# EAGLE design schema_v1_0 (EAGLE 5.12)
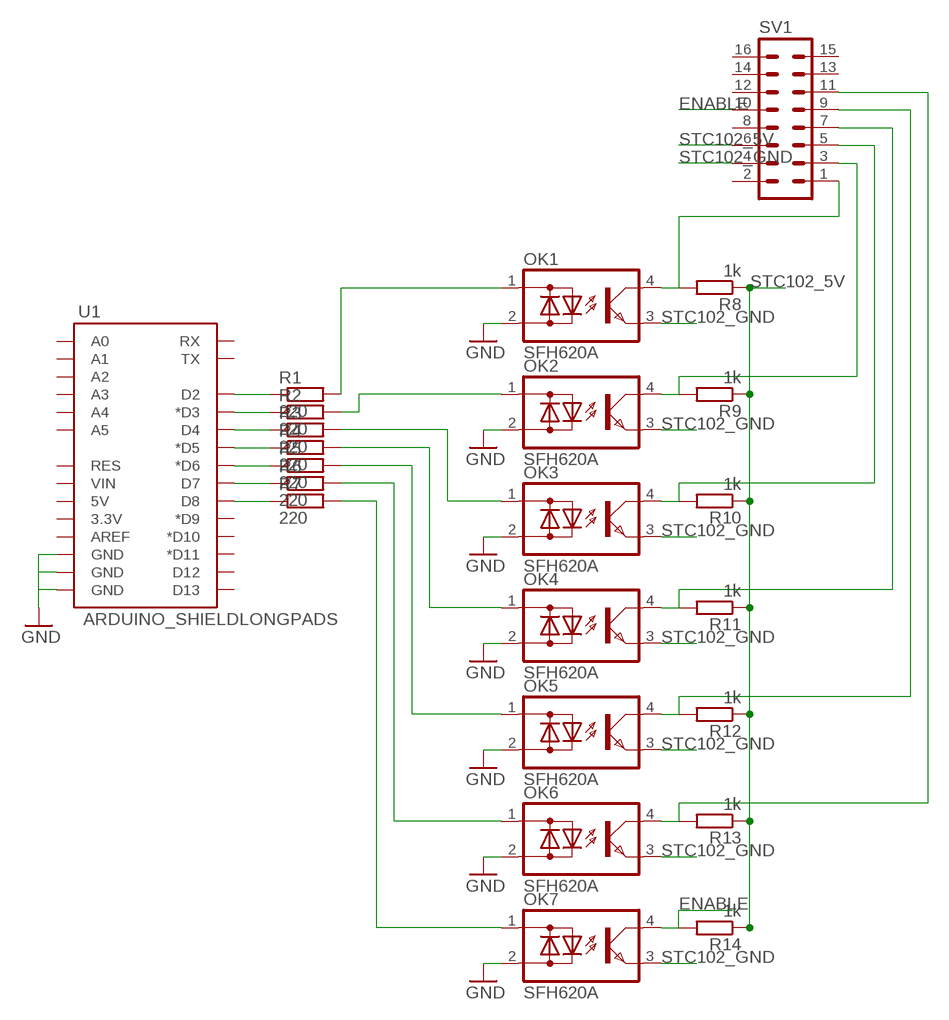
[diagram p0: schematic, sheet 1]

## Parts
OK1  SFH620A  [DIL04]
OK2  SFH620A  [DIL04]
OK3  SFH620A  [DIL04]
OK4  SFH620A  [DIL04]
OK5  SFH620A  [DIL04]
OK6  SFH620A  [DIL04]
OK7  SFH620A  [DIL04]
R1  220  R-EU_0207/10  [0207/10]
R2  220  R-EU_0207/10  [0207/10]
R3  220  R-EU_0207/10  [0207/10]
R4  220  R-EU_0207/10  [0207/10]
R5  220  R-EU_0207/10  [0207/10]
R6  220  R-EU_0207/10  [0207/10]
R7  220  R-EU_0207/10  [0207/10]
R8  1k  R-EU_0207/10  [0207/10]
R9  1k  R-EU_0207/10  [0207/10]
R10  1k  R-EU_0207/10  [0207/10]
R11  1k  R-EU_0207/10  [0207/10]
R12  1k  R-EU_0207/10  [0207/10]
R13  1k  R-EU_0207/10  [0207/10]
R14  1k  R-EU_0207/10  [0207/10]
SV1  MA08-2  [MA08-2]
U1  ARDUINO_SHIELDLONGPADS  [DUEMILANOVE_SHIELD_LONGPADS]

## Nets
ENABLE: OK7.4(C) R14.2 SV1.10
GND: OK1.2(AC2) OK2.2(AC2) OK3.2(AC2) OK4.2(AC2) OK5.2(AC2) OK6.2(AC2) OK7.2(AC2) U1.GND@0(GND) U1.GND@1(GND) U1.GND@2(GND)
N$1: R1.1 U1.D2
N$2: R2.1 U1.D3(*D3)
N$3: R3.1 U1.D4
N$4: R4.1 U1.D5(*D5)
N$5: R5.1 U1.D6(*D6)
N$6: R6.1 U1.D7
N$7: R7.1 U1.D8
N$8: OK1.4(C) R8.2 SV1.1
N$9: OK2.4(C) R9.2 SV1.3
N$10: OK3.4(C) R10.2 SV1.5
N$11: OK4.4(C) R11.2 SV1.7
N$12: OK5.4(C) R12.2 SV1.9
N$13: OK6.4(C) R13.2 SV1.11
N$23: OK1.1(AC1) R1.2
N$24: OK2.1(AC1) R2.2
N$25: OK3.1(AC1) R3.2
N$26: OK4.1(AC1) R4.2
N$27: OK5.1(AC1) R5.2
N$28: OK6.1(AC1) R6.2
N$29: OK7.1(AC1) R7.2
STC102_5V: R8.1 R9.1 R10.1 R11.1 R12.1 R13.1 R14.1 SV1.6
STC102_GND: OK1.3(E) OK2.3(E) OK3.3(E) OK4.3(E) OK5.3(E) OK6.3(E) OK7.3(E) SV1.4
Unconnected: SV1.2 SV1.8 SV1.12 SV1.13 SV1.14 SV1.15 SV1.16 U1.3.3V U1.5V U1.A0 U1.A1 U1.A2 U1.A3 U1.A4 U1.A5 U1.AREF U1.D9(*D9) U1.D10(*D10) U1.D11(*D11) U1.D12 U1.D13 U1.RES U1.RX U1.TX U1.VIN

## Library data of the parts
OK1-OK7 = optocoupler:SFH620: Optocoupler, Phototransistor Output, AC Input Source: http://www.vishay.com/docs/83675/sfh620.pdf; MPN: SFH620A-2; OC_FARNELL: 1469594; OC_NEWARK: 97K9546
R1-R14 = rcl:R-EU_: RESISTOR, European symbol
SV1 = con-lstb:MA08-2: PIN HEADER; OC_FARNELL: unknown; OC_NEWARK: unknown
U1 = SparkFun:ARDUINO_SHIELD

## Board
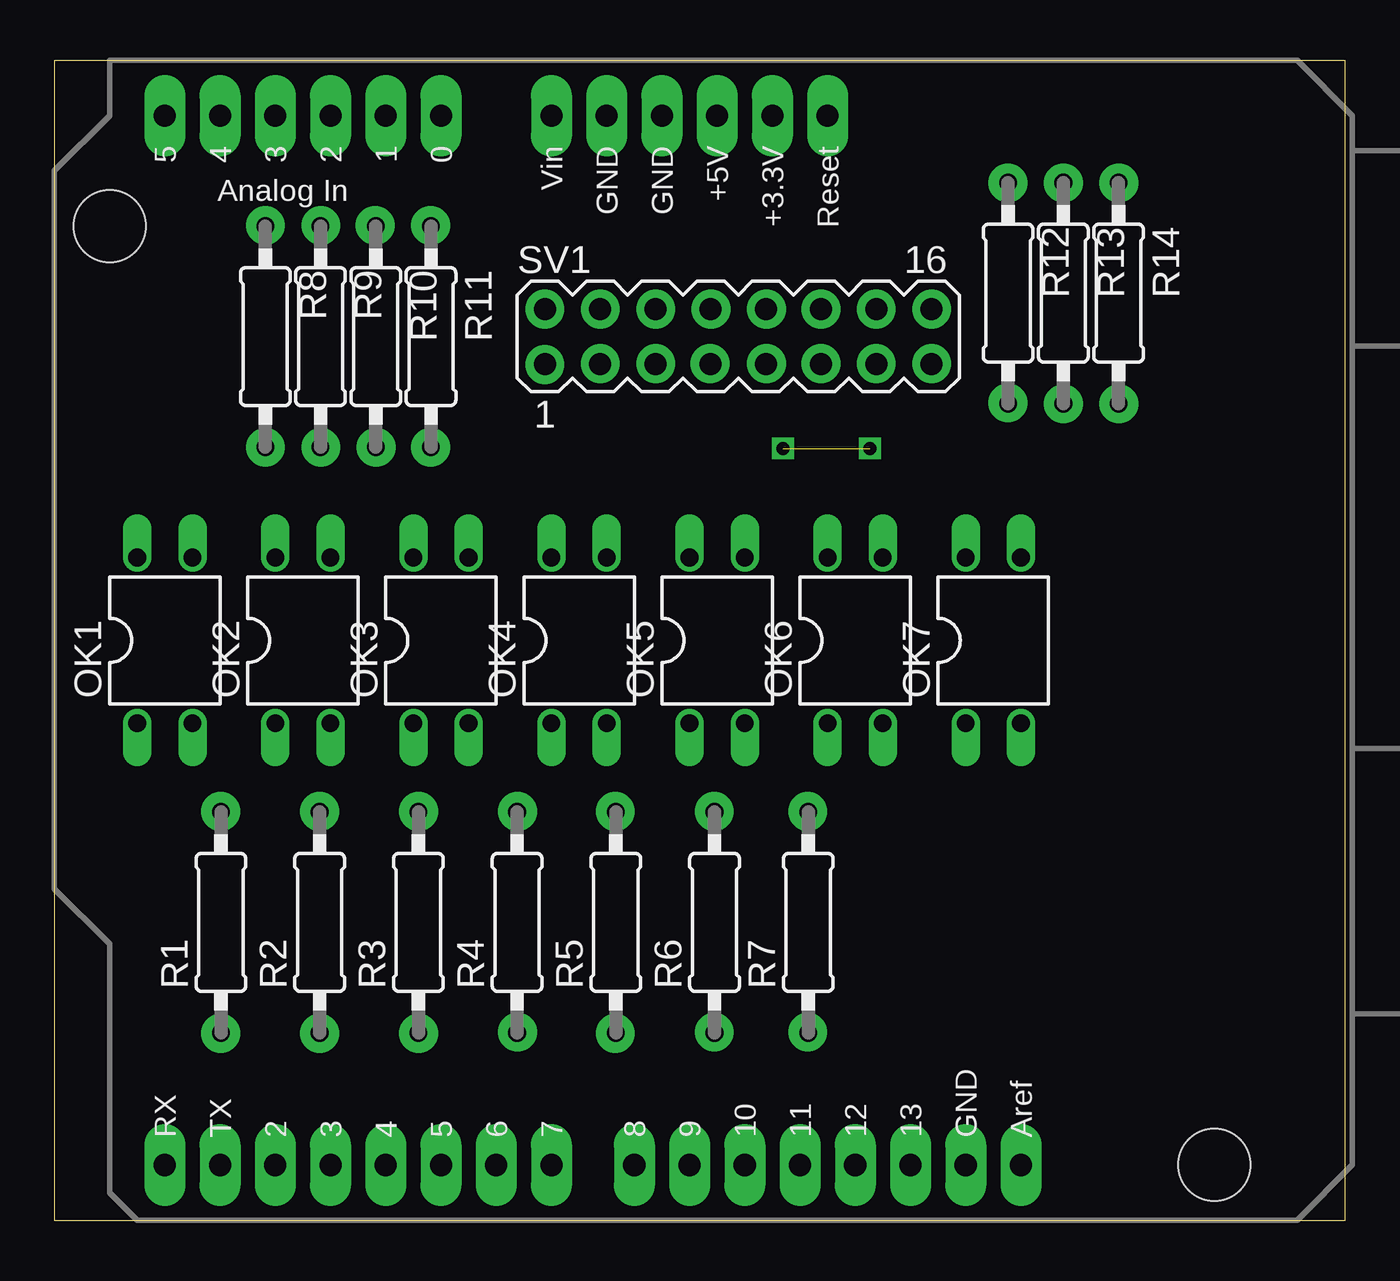
[diagram p1: board, top side]
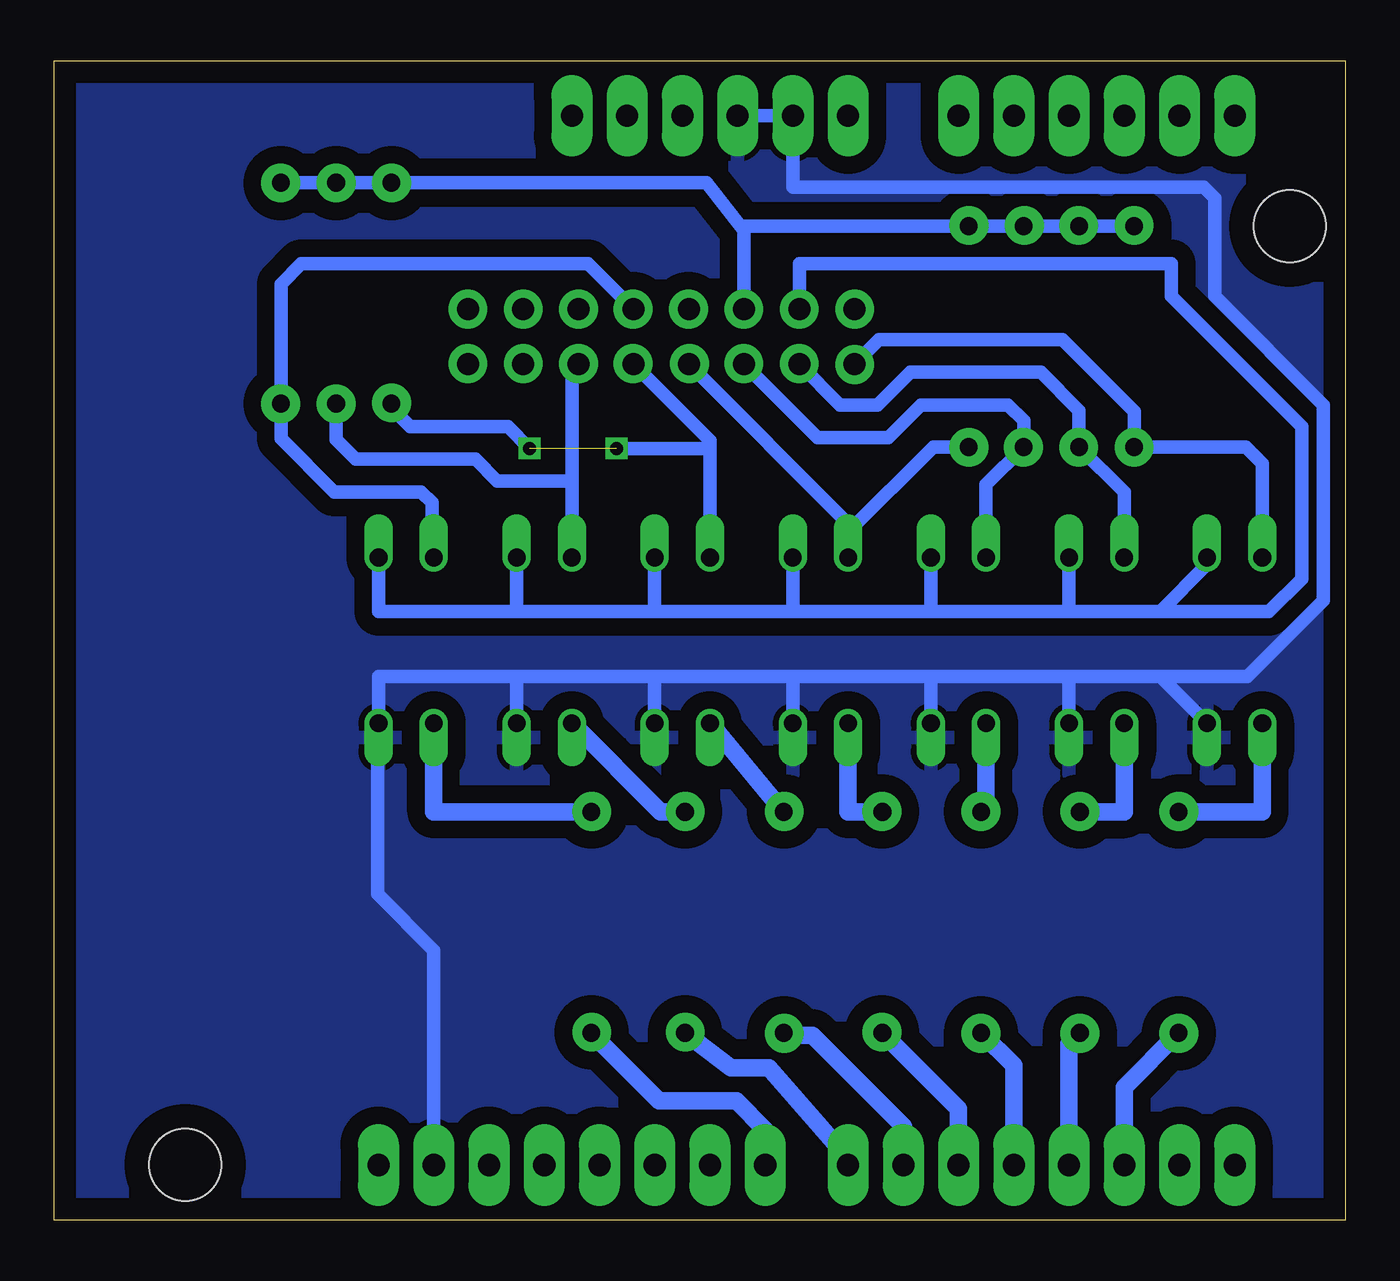
[diagram p2: board, bottom side, seen from below]

Size 59.36 x 53.33 mm. Coordinates in mm from the lower left corner, seen from the top.
Outline: 0,0 59.36,0 59.36,53.33 0,53.33 0,0
Copper layers (1*16): layer 1 0.035mm / dielectric 1.5mm / Bottom 0.035mm
Design rules "default": minimum track width 10mil, minimum drill 24mil, track to track 8mil, track to pad 8mil, pad to pad 8mil, via to via 8mil, smd to smd 8mil, copper to edge 40mil, drill to drill 8mil, minimum pad ring 10mil, minimum via ring 8mil, stop-mask expansion 4mil, vias tented up to drill 0mil, thermal gap 10mil

### Footprints (pad centres in the part's own frame; a part is rotated, then mirrored left to right if it is on the bottom)
DIL04 = drill 0.813 offset: 1 -1.27,-3.81; 2 1.27,-3.81; 3 1.27,3.81; 4 -1.27,3.81
0207/10 = drill 0.813 octagon: 1 -5.08,0; 2 5.08,0
MA08-2 = drill 1.016 octagon: 1 -8.89,-1.27; 2 -8.89,1.27; 3 -6.35,-1.27; 4 -6.35,1.27; 5 -3.81,-1.27; 6 -3.81,1.27; 7 -1.27,-1.27; 8 -1.27,1.27; 9 1.27,-1.27; 10 1.27,1.27; 11 3.81,-1.27; 12 3.81,1.27; 13 6.35,-1.27; 14 6.35,1.27; 15 8.89,-1.27; 16 8.89,1.27
DUEMILANOVE_SHIELD_LONGPADS = drill 1.016 pad 1.88 long: 3.3V 50.8,26.67; 5V 50.8,29.21; A0 50.8,41.91; A1 50.8,44.45; A2 50.8,46.99; A3 50.8,49.53; A4 50.8,52.07; A5 50.8,54.61; AREF 2.54,15.24; D2 2.54,49.53; D3 2.54,46.99; D4 2.54,44.45; D5 2.54,41.91; D6 2.54,39.37; D7 2.54,36.83; D8 2.54,33.02; D9 2.54,30.48; D10 2.54,27.94; D11 2.54,25.4; D12 2.54,22.86; D13 2.54,20.32; GND@0 50.8,31.75; GND@1 50.8,34.29; GND@2 2.54,17.78; RES 50.8,24.13; RX 2.54,54.61; TX 2.54,52.07; VIN 50.8,36.83 | hole 3.302: 45.72,57.15; 2.54,6.35

### Placement (x,y rotation side)
OK1  5.08,26.67 0 top
OK2  11.43,26.67 0 top
OK3  17.78,26.67 0 top
OK4  24.13,26.67 0 top
OK5  30.48,26.67 0 top
OK6  36.83,26.67 0 top
OK7  43.18,26.67 0 top
R1  7.66,13.7 90 top
R2  12.2,13.7 90 top
R3  16.74,13.7 90 top
R4  21.28,13.7 90 top
R5  25.82,13.7 90 top
R6  30.36,13.7 90 top
R7  34.67,13.7 90 top
R8  9.7,40.64 270 top
R9  12.24,40.64 270 top
R10  14.78,40.64 270 top
R11  17.32,40.64 270 top
R12  43.86,42.64 270 top
R13  46.4,42.64 270 top
R14  48.94,42.64 270 top
SV1  31.45,40.64 0 top
U1  59.69,0 90 top

### Tracks (layer width: path | path; a pad name or v marks a point on that pad's centre or on a via)
ENABLE
  Bottom 0.61: SV1.10 34.81,44 48,44 48.94,43.06 R14.2 48.94,35.94 46.5,33.5 42.5,33.5 42,33 42,30.57 OK7.4
GND
  Bottom 0.61: 8.49,25 OK1.2 | 8.49,25 12.7,25 | 12.7,25 OK2.2 | 19.05,25 OK3.2 | 12.7,25 19.05,25 | 25.4,25 OK4.2 | 19.05,25 25.4,25 | 31.75,25 OK5.2 | 25.4,25 31.75,25 | 38.1,25 OK6.2 | 31.75,25 38.1,25 | 38.1,25 44.45,25 OK7.2 44.5,22.81 44.5,15 41.91,12.41 U1.GND@2 | U1.GND@0 U1.GND@1 25.4,47.5 6.5,47.5 6,47 6,42.5 1,37.5 1,28.5 4.5,25 8.49,25
  pour Bottom (isolate 0.813): 0.5,53 59,53 59,0.5 0.5,0.5
N$1
  Bottom 0.813: U1.D2 10.16,6.12 R1.1
N$2
  Bottom 0.61: 12.7,8.12 R2.1
  Bottom 0.813: U1.D3 12.7,8.12
N$3
  Bottom 0.813: U1.D4 15.24,7.12 R3.1
N$4
  Bottom 0.813: U1.D5 17.78,5.12 R4.1
N$5  (via drill 0.5 pad 1.78)
  Bottom 0.61: 25.7,8.5 v25.8,8.6 R5.1
  Bottom 0.813: U1.D6 20.32,4.32 24.5,8.5 25.7,8.5
N$6
  Bottom 0.813: U1.D7 22.86,2.86 26.5,7 28.24,7 R6.1
N$7
  Bottom 0.813: U1.D8 26.67,4.17 28,5.5 31.55,5.5 R7.1
N$8
  Bottom 0.61: OK1.4 3.81,34.81 4.56,35.56 R8.2 9.7,37.2 13,40.5 21.43,40.5 SV1.1
N$9
  Bottom 0.61: OK2.4 10.16,33.48 R9.2 12.24,37.24 14,39 20,39 21.5,37.5 23.23,37.5 SV1.3
N$10
  Bottom 0.61: OK3.4 16.51,33.83 R10.2 14.78,36.78 15.5,37.5 19.5,37.5 21,36 24.27,36 SV1.5
N$11
  Bottom 0.61: R11.2 18.94,35.56 22.86,31.64 OK4.4 22.86,32.05 SV1.7
N$12  (via drill 0.6)  (1 unrouted)
  Bottom 0.61: SV1.9 29.21,35.86 29.21,35.5 | OK5.4 29.21,35.5 | 29.21,35.5 v33.5,35.5 | R12.2 43.86,37.36 43,36.5 38.5,36.5 v37.5,35.5
N$13  (via drill 0.5 pad 1.78)
  Bottom 0.61: SV1.11 35.56,39.07 35.56,34 | OK6.4 35.56,34 | R13.2 v46.4,37.55 46.4,35.9 45.5,35 40,35 39,34 35.56,34
N$14  (via drill 0.5 pad 1.78)
  other vias: 7.65,8.6
N$15  (via drill 0.5 pad 1.78)
  other vias: 12.2,8.6
N$16  (via drill 0.5 pad 1.78)
  other vias: 16.75,8.6
N$17  (via drill 0.5 pad 1.78)
  other vias: 21.3,8.65
N$18  (via drill 0.5 pad 1.78)
  other vias: 30.35,8.65
N$19  (via drill 0.5 pad 1.78)
  other vias: 34.65,8.65
N$20  (via drill 0.5 pad 1.78)
  other vias: 7.65,18.8
N$21  (via drill 0.5 pad 1.78)
  other vias: 12.2,18.8
N$22  (via drill 0.5 pad 1.78)
  other vias: 16.75,18.8
N$23
  Bottom 0.813: R1.2 3.81,18.78 OK1.1
N$24
  Bottom 0.813: R2.2 10.16,18.78 OK2.1
N$25
  Bottom 0.61: R3.2 16.51,18.78
  Bottom 0.813: 16.51,18.78 OK3.1
N$26
  Bottom 0.813: R4.2 22.86,18.78 OK4.1
N$27
  Bottom 0.813: R5.2 OK5.1
N$28
  Bottom 0.813: R6.2 31.48,18.78 OK6.1
N$29
  Bottom 0.813: R7.2 41.91,18.78 OK7.1
N$30  (via drill 0.5 pad 1.78)
  other vias: 21.3,18.8
N$31  (via drill 0.5 pad 1.78)
  other vias: 25.8,18.8
N$32  (via drill 0.5 pad 1.78)
  other vias: 30.35,18.8
N$33  (via drill 0.5 pad 1.78)
  other vias: 34.65,18.8
N$34  (via drill 0.5 pad 1.78)
  other vias: 9.7,35.55
N$35  (via drill 0.5 pad 1.78)
  other vias: 12.25,35.55
N$36  (via drill 0.5 pad 1.78)
  other vias: 14.8,35.55
N$37  (via drill 0.5 pad 1.78)
  other vias: 17.3,35.55
N$38  (via drill 0.5 pad 1.78)
  other vias: 43.85,37.6
N$39  (via drill 0.5 pad 1.78)
  other vias: 48.95,37.55
N$40  (via drill 0.5 pad 1.78)
  other vias: 48.95,47.7
N$41  (via drill 0.5 pad 1.78)
  other vias: 46.4,47.7
N$42  (via drill 0.5 pad 1.78)
  other vias: 43.85,47.7
N$43  (via drill 0.5 pad 1.78)
  other vias: 9.7,45.75
N$44  (via drill 0.5 pad 1.78)
  other vias: 12.25,45.75
N$45  (via drill 0.5 pad 1.78)
  other vias: 14.75,45.75
N$46  (via drill 0.5 pad 1.78)
  other vias: 17.3,45.75
N$47  (via drill 0.5 pad 1.78)
  other vias: 22.55,39.35
N$48  (via drill 0.5 pad 1.78)
  other vias: 25.1,39.4
N$49  (via drill 0.5 pad 1.78)
  other vias: 27.65,39.4
N$50  (via drill 0.5 pad 1.78)
  other vias: 30.15,39.4
N$51  (via drill 0.5 pad 1.78)
  other vias: 32.75,39.4
N$52  (via drill 0.5 pad 1.78)
  other vias: 35.25,39.4
N$53  (via drill 0.5 pad 1.78)
  other vias: 37.8,39.4
N$54  (via drill 0.5 pad 1.78)
  other vias: 40.35,39.4
N$55  (via drill 0.5 pad 1.78)
  other vias: 40.35,41.9
N$56  (via drill 0.5 pad 1.78)
  other vias: 37.8,41.9
N$57  (via drill 0.5 pad 1.78)
  other vias: 35.25,41.9
N$58  (via drill 0.5 pad 1.78)
  other vias: 32.75,41.9
N$59  (via drill 0.5 pad 1.78)
  other vias: 30.2,41.9
N$60  (via drill 0.5 pad 1.78)
  other vias: 27.65,41.9
N$61  (via drill 0.5 pad 1.78)
  other vias: 25.1,41.9
N$62  (via drill 0.5 pad 1.78)
  other vias: 22.55,41.9
STC102_5V
  Bottom 0.61: R8.1 R9.1 R10.1 R11.1 27.64,45.72 27.64,45.5 | R14.1 R13.1 R12.1 29.36,47.72 27.64,45.5 | 27.64,45.5 SV1.6
STC102_GND
  Bottom 0.61: OK1.3 6.35,30.15 8.5,28 | 8.5,28 12.7,28 | 12.7,28 OK2.3 | 19.05,28 OK3.3 | 12.7,28 19.05,28 | 25.4,28 OK4.3 | 19.05,28 25.4,28 | 31.75,28 OK5.3 | 25.4,28 31.75,28 | 38.1,28 OK6.3 | 31.75,28 38.1,28 | OK7.3 44.45,28 38.1,28 | 8.5,28 3.5,28 2,29.5 2,36.5 8,42.5 8,44 25.1,44 SV1.4